# EasyEDA schematic 1-Schematic_N64 SpyDVI.json
TITLE: N64 BBPico; REV: 1.0; Date: 2024-02-06; Sheet: 1/1; Drawn By: Chobrenga; Company: N/A
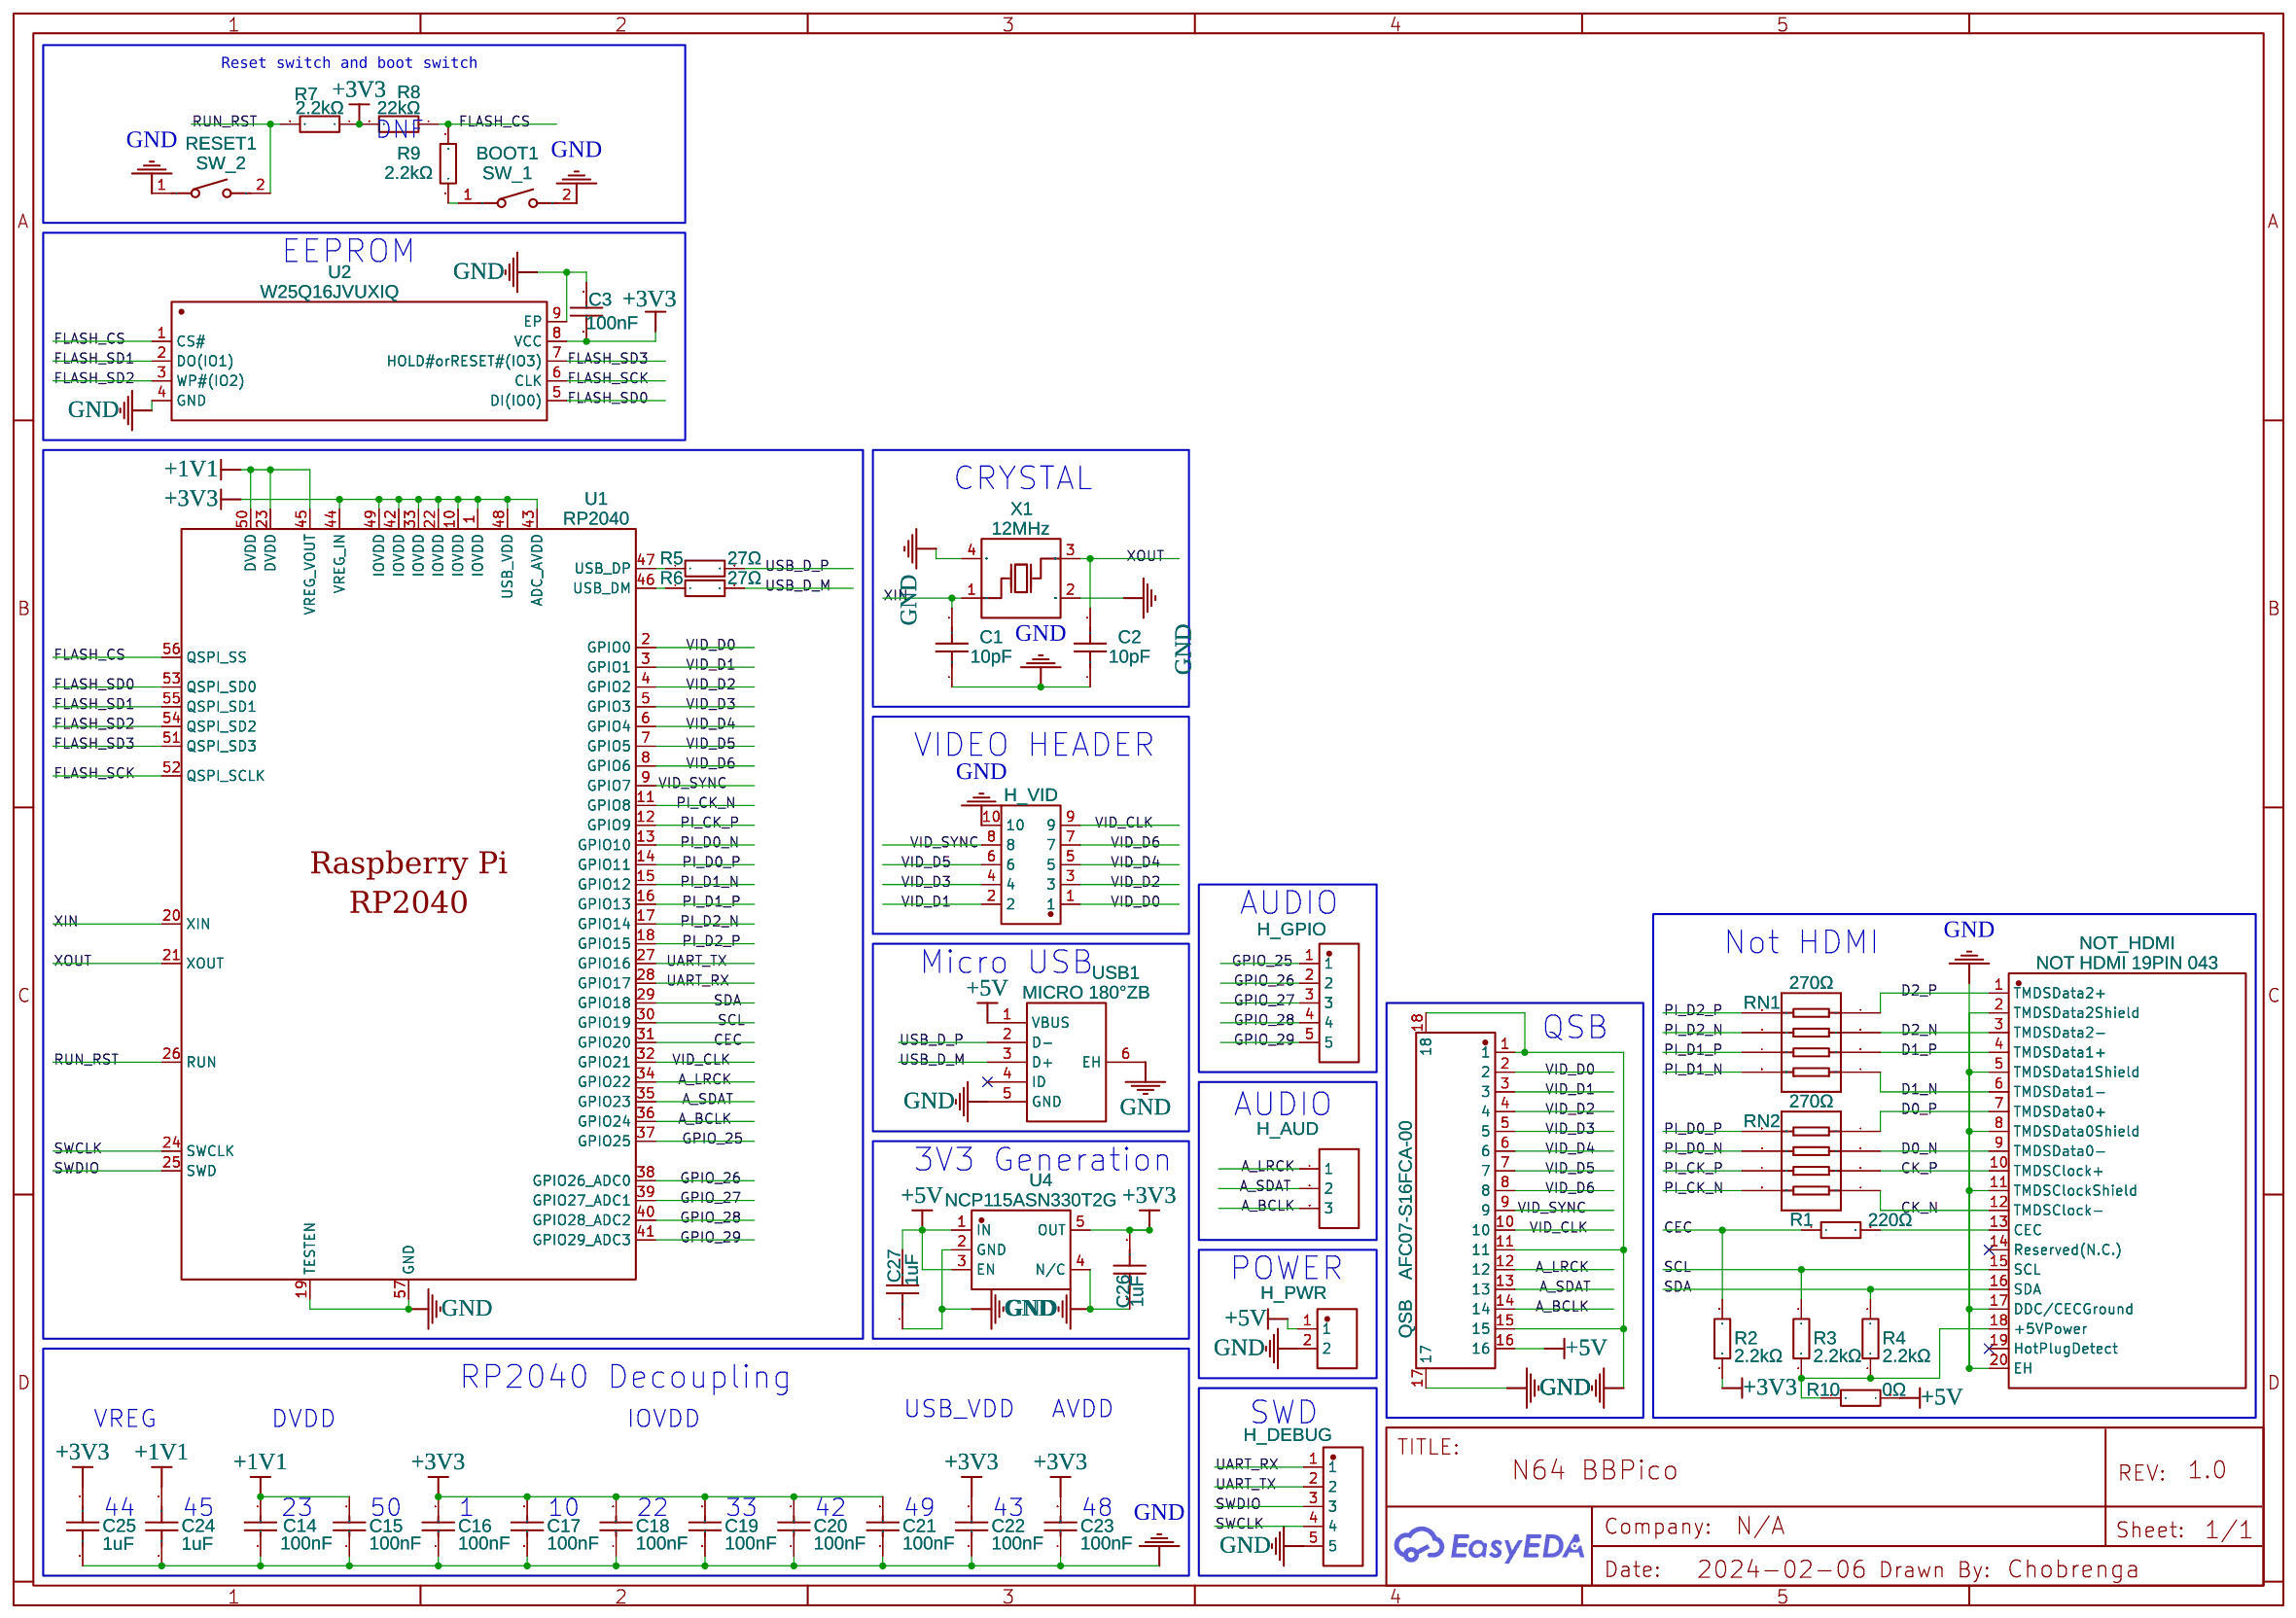
[diagram p0: schematic sheet]

## Parts
BOOT1  SW_1  [SW-SMD_L3.9-W3.0-P4.45]
C1  10pF  [C0402]
C2  10pF  [C0402]
C3  100nF  [C0402]
C14  100nF  [C0402]
C15  100nF  [C0402]
C16  100nF  [C0402]
C17  100nF  [C0402]
C18  100nF  [C0402]
C19  100nF  [C0402]
C20  100nF  [C0402]
C21  100nF  [C0402]
C22  100nF  [C0402]
C23  100nF  [C0402]
C24  1uF  [C0402]
C25  1uF  [C0402]
C26  1uF  [C0402]
C27  1uF  [C0402]
H_AUD  Header-Male-2.54_1x3  [HDR-TH_3P-P2.54-V-M-1]
H_DEBUG  PZ254V-11-05P  [HDR-TH_5P-P2.54-V-M]
H_GPIO  PZ254V-11-05P  [HDR-TH_5P-P2.54-V-M]
H_PWR  PZ254V-11-02P  [HDR-TH_2P-P2.54-V-M]
H_VID  PZ254V-12-10P  [HDR-TH_10P-P2.54-V-M-R2-C5-S2.54]
NOT_HDMI  NOT HDMI 19PIN 043  [HDMI-SMD_HDMI-19PIN-043]
QSB  AFC07-S16FCA-00  [FPC-SMD_P0.50-16P_LCS-SJ-H2.0]
R1  220Ω  [R0402]
R2  2.2kΩ  [R0402]
R3  2.2kΩ  [R0402]
R4  2.2kΩ  [R0402]
R5  27Ω  [R0402]
R6  27Ω  [R0402]
R7  2.2kΩ  [R0402]
R8  22kΩ  [R0402]
R9  2.2kΩ  [R0402]
R10  0Ω  [R0603]
RESET1  SW_2  [SW-SMD_L3.9-W3.0-P4.45]
RN1  270Ω  [RES-ARRAY-SMD_0804-8P-L2.0-W1.0-BL]
RN2  270Ω  [RES-ARRAY-SMD_0804-8P-L2.0-W1.0-BL]
U1  RP2040  [LQFN-56_L7.0-W7.0-P0.4-EP]
U2  W25Q16JVUXIQ  [USON-8_L3.0-W2.0-P0.50-BL-EP]
U4  NCP115ASN330T2G  [SOT-23-5_L3.0-W1.7-P0.95-LS2.8-BL]
USB1  MICRO 180°ZB  [MICRO-USB-TH_MICRO-180-ZB]
X1  12MHz  [CRYSTAL-SMD_4P-L3.2-W2.5-BL]

## Library data of the parts
BOOT1 RESET1 = TS-1088-AR02016: Contributor: LCSC; Supplier: LCSC; Supplier Part: C720477; Manufacturer: XUNPU(讯普); JLCPCB Part Class: Extended Part
C1 C2 = CL05C100JB5NNNC: Supplier: LCSC; Manufacturer: SAMSUNG(三星); Supplier Part: C32949; JLCPCB Part Class: Basic Part
C3 C14-C23 = CL05B104KO5NNNC: Supplier: LCSC; Manufacturer: SAMSUNG(三星); Supplier Part: C1525; JLCPCB Part Class: Basic Part
C24-C27 = TCC0402X5R105K100AT: Contributor: LCSC; Supplier: LCSC; Supplier Part: C380293; Manufacturer: CCTC(三环); JLCPCB Part Class: Extended Part
H_AUD = Header-Male-2.54_1x3: Supplier: LCSC; Manufacturer: BOOMELE(博穆精密); Manufacturer Part: 2.54-1*3P针; Supplier Part: C49257; JLCPCB Part Class: Extended Part
H_DEBUG H_GPIO = PZ254V-11-05P: Contributor: LCSC; Supplier: LCSC; Supplier Part: C492404; Manufacturer: XFCN(兴飞); JLCPCB Part Class: Extended Part
H_PWR = PZ254V-11-02P: Contributor: LCSC; Supplier: LCSC; Supplier Part: C492401; Manufacturer: XFCN(兴飞); JLCPCB Part Class: Extended Part
H_VID = PZ254V-12-10P: Contributor: LCSC; Supplier: LCSC; Supplier Part: C492422; Manufacturer: XFCN(兴飞); JLCPCB Part Class: Extended Part
NOT_HDMI = HDMI 19PIN 043: Contributor: LCSC; Supplier: LCSC; Supplier Part: C2858275; Manufacturer: SHOU HAN(首韩); JLCPCB Part Class: Extended Part; Package Display: No
QSB = AFC07-S16FCA-00: Contributor: LCSC; Supplier: LCSC; Supplier Part: C262563; Manufacturer: JS(钜硕电子); JLCPCB Part Class: Extended Part
R1 = 0402WGF2200TCE: Supplier: LCSC; Manufacturer: UNI-ROYAL(厚声); Supplier Part: C25091; JLCPCB Part Class: Basic Part
R2-R4 R7 R9 = 0402WGF2201TCE: Supplier: LCSC; Manufacturer: UNI-ROYAL(厚声); Supplier Part: C25879; JLCPCB Part Class: Basic Part
R5 R6 = 0402WGF270JTCE: Supplier: LCSC; Manufacturer: UNI-ROYAL(厚声); Supplier Part: C25100; JLCPCB Part Class: Extended Part
R8 = 0402WGF2202TCE: Package Display: No
R10 = 0603WAF0000T5E: Supplier: LCSC; Manufacturer: UNI-ROYAL(厚声); Supplier Part: C21189; JLCPCB Part Class: Basic Part
RN1 RN2 = CAT10-271J4LF: Contributor: LCSC; Supplier: LCSC; Supplier Part: C148510; Manufacturer: BOURNS; JLCPCB Part Class: Extended Part
U1 = RP2040: Contributor: LCSC; Supplier: LCSC; Supplier Part: C2040; Manufacturer: Raspberry Pi(树莓派); JLCPCB Part Class: Extended Part
U2 = W25Q16JVUXIQ: Contributor: lcsc; Supplier: LCSC; Supplier Part: C2843335; Manufacturer: WINBOND(华邦); JLCPCB Part Class: Extended Part
U4 = NCP115ASN330T2G: Contributor: LCSC; Supplier: LCSC; Supplier Part: C603505; Manufacturer: onsemi(安森美); JLCPCB Part Class: Extended Part
USB1 = MICRO 180°ZB: Contributor: LCSC; Supplier: LCSC; Supplier Part: C668588; Manufacturer: SHOU HAN(首韩); JLCPCB Part Class: Extended Part
X1 = X322512MMB4SI: Supplier: LCSC; Manufacturer: YXC(扬兴晶振); Supplier Part: C50430; JLCPCB Part Class: Extended Part

## Nets
+1V1: C14.2 C15.2 C24.2 U1.23(DVDD) U1.45(VREG_VOUT) U1.50(DVDD)
+3V3: C3.1 C16.2 C17.2 C18.2 C19.2 C20.2 C21.2 C22.2 C23.2 C25.2 C26.2 R2.1 R7.1 R8.2 U1.1(IOVDD) U1.10(IOVDD) U1.22(IOVDD) U1.33(IOVDD) U1.42(IOVDD) U1.43(ADC_AVDD) U1.44(VREG_IN) U1.48(USB_VDD) U1.49(IOVDD) U2.8(VCC) U4.5(OUT)
+5V: C27.2 H_PWR.1 QSB.16 R10.1 U4.1(IN) U4.3(EN) USB1.1(VBUS)
GND: BOOT1.2 C1.1 C2.1 C3.2 C14.1 C15.1 C16.1 C17.1 C18.1 C19.1 C20.1 C21.1 C22.1 C23.1 C24.1 C25.1 C26.1 C27.1 H_DEBUG.5 H_PWR.2 H_VID.10 NOT_HDMI.2(TMDSData2Shield) NOT_HDMI.5(TMDSData1Shield) NOT_HDMI.8(TMDSData0Shield) NOT_HDMI.11(TMDSClockShield) NOT_HDMI.17(DDC/CECGround) NOT_HDMI.20(EH) QSB.1 QSB.11 QSB.15 QSB.17 QSB.18 RESET1.1 U1.19(TESTEN) U1.57(GND) U2.4(GND) U2.9(EP) U4.2(GND) U4.4(N/C) USB1.5(GND) USB1.6(EH) X1.2(GND) X1.4(GND)
A_BCLK: H_AUD.3 QSB.14 U1.36(GPIO24)
A_LRCK: H_AUD.1 QSB.12 U1.34(GPIO22)
A_SDAT: H_AUD.2 QSB.13 U1.35(GPIO23)
CEC: R1.1 R2.2 U1.31(GPIO20)
CK_N: NOT_HDMI.12(TMDSClock-) RN2.1
CK_P: NOT_HDMI.10(TMDSClock+) RN2.2
D0_N: NOT_HDMI.9(TMDSData0-) RN2.3
D0_P: NOT_HDMI.7(TMDSData0+) RN2.4
D1_N: NOT_HDMI.6(TMDSData1-) RN1.1
D1_P: NOT_HDMI.4(TMDSData1+) RN1.2
D2_N: NOT_HDMI.3(TMDSData2-) RN1.3
D2_P: NOT_HDMI.1(TMDSData2+) RN1.4
FLASH_CS: R8.1 R9.2 U1.56(QSPI_SS) U2.1(CS#)
FLASH_SCK: U1.52(QSPI_SCLK) U2.6(CLK)
FLASH_SD0: U1.53(QSPI_SD0) U2.5(DI(IO0))
FLASH_SD1: U1.55(QSPI_SD1) U2.2(DO(IO1))
FLASH_SD2: U1.54(QSPI_SD2) U2.3(WP#(IO2))
FLASH_SD3: U1.51(QSPI_SD3) U2.7(HOLD#orRESET#(IO3))
GPIO_25: H_GPIO.1 U1.37(GPIO25)
GPIO_26: H_GPIO.2 U1.38(GPIO26_ADC0)
GPIO_27: H_GPIO.3 U1.39(GPIO27_ADC1)
GPIO_28: H_GPIO.4 U1.40(GPIO28_ADC2)
GPIO_29: H_GPIO.5 U1.41(GPIO29_ADC3)
PI_CK_N: RN2.8 U1.11(GPIO8)
PI_CK_P: RN2.7 U1.12(GPIO9)
PI_D0_N: RN2.6 U1.13(GPIO10)
PI_D0_P: RN2.5 U1.14(GPIO11)
PI_D1_N: RN1.8 U1.15(GPIO12)
PI_D1_P: RN1.7 U1.16(GPIO13)
PI_D2_N: RN1.6 U1.17(GPIO14)
PI_D2_P: RN1.5 U1.18(GPIO15)
RUN_RST: R7.2 RESET1.2 U1.26(RUN)
SCL: NOT_HDMI.15(SCL) R3.2 U1.30(GPIO19)
SDA: NOT_HDMI.16(SDA) R4.2 U1.29(GPIO18)
SWCLK: H_DEBUG.4 U1.24(SWCLK)
SWDIO: H_DEBUG.3 U1.25(SWD)
UART_RX: H_DEBUG.1 U1.28(GPIO17)
UART_TX: H_DEBUG.2 U1.27(GPIO16)
USB_D_M: R6.2 USB1.3(D+)
USB_D_P: R5.2 USB1.2(D-)
VID_CLK: H_VID.9 QSB.10 U1.32(GPIO21)
VID_D0: H_VID.1 QSB.2 U1.2(GPIO0)
VID_D1: H_VID.2 QSB.3 U1.3(GPIO1)
VID_D2: H_VID.3 QSB.4 U1.4(GPIO2)
VID_D3: H_VID.4 QSB.5 U1.5(GPIO3)
VID_D4: H_VID.5 QSB.6 U1.6(GPIO4)
VID_D5: H_VID.6 QSB.7 U1.7(GPIO5)
VID_D6: H_VID.7 QSB.8 U1.8(GPIO6)
VID_SYNC: H_VID.8 QSB.9 U1.9(GPIO7)
XIN: C1.2 U1.20(XIN) X1.1(OSC1)
XOUT: C2.2 U1.21(XOUT) X1.3(OSC2)
Net-(BOOT1-1): BOOT1.1 R9.1
Net-(NOT_HDMI-13): NOT_HDMI.13(CEC) R1.2
Net-(NOT_HDMI-18): NOT_HDMI.18(+5VPower) R3.1 R4.1 R10.2
Net-(R5-1): R5.1 U1.47(USB_DP)
Net-(R6-1): R6.1 U1.46(USB_DM)

Not connected (* = marked no-connect by the designer): NOT_HDMI 14(Reserved(N.C.))* 19(HotPlugDetect)*; USB1 4(ID)*

## Notes on the sheet
- Reset switch and boot switch
- DNF
- EEPROM
- CRYSTAL
- VIDEO HEADER
- AUDIO
- Not HDMI
- Micro USB
- QSB
- AUDIO
- 3V3 Generation
- POWER
- RP2040 Decoupling
- USB_VDD
- AVDD
- SWD
- VREG
- DVDD
- IOVDD
- 44
- 45
- 23
- 50
- 1
- 10
- 22
- 33
- 42
- 49
- 43
- 48
